# EAGLE design untitled (EAGLE 9.6.2)
UNTITLED: Arduio uno
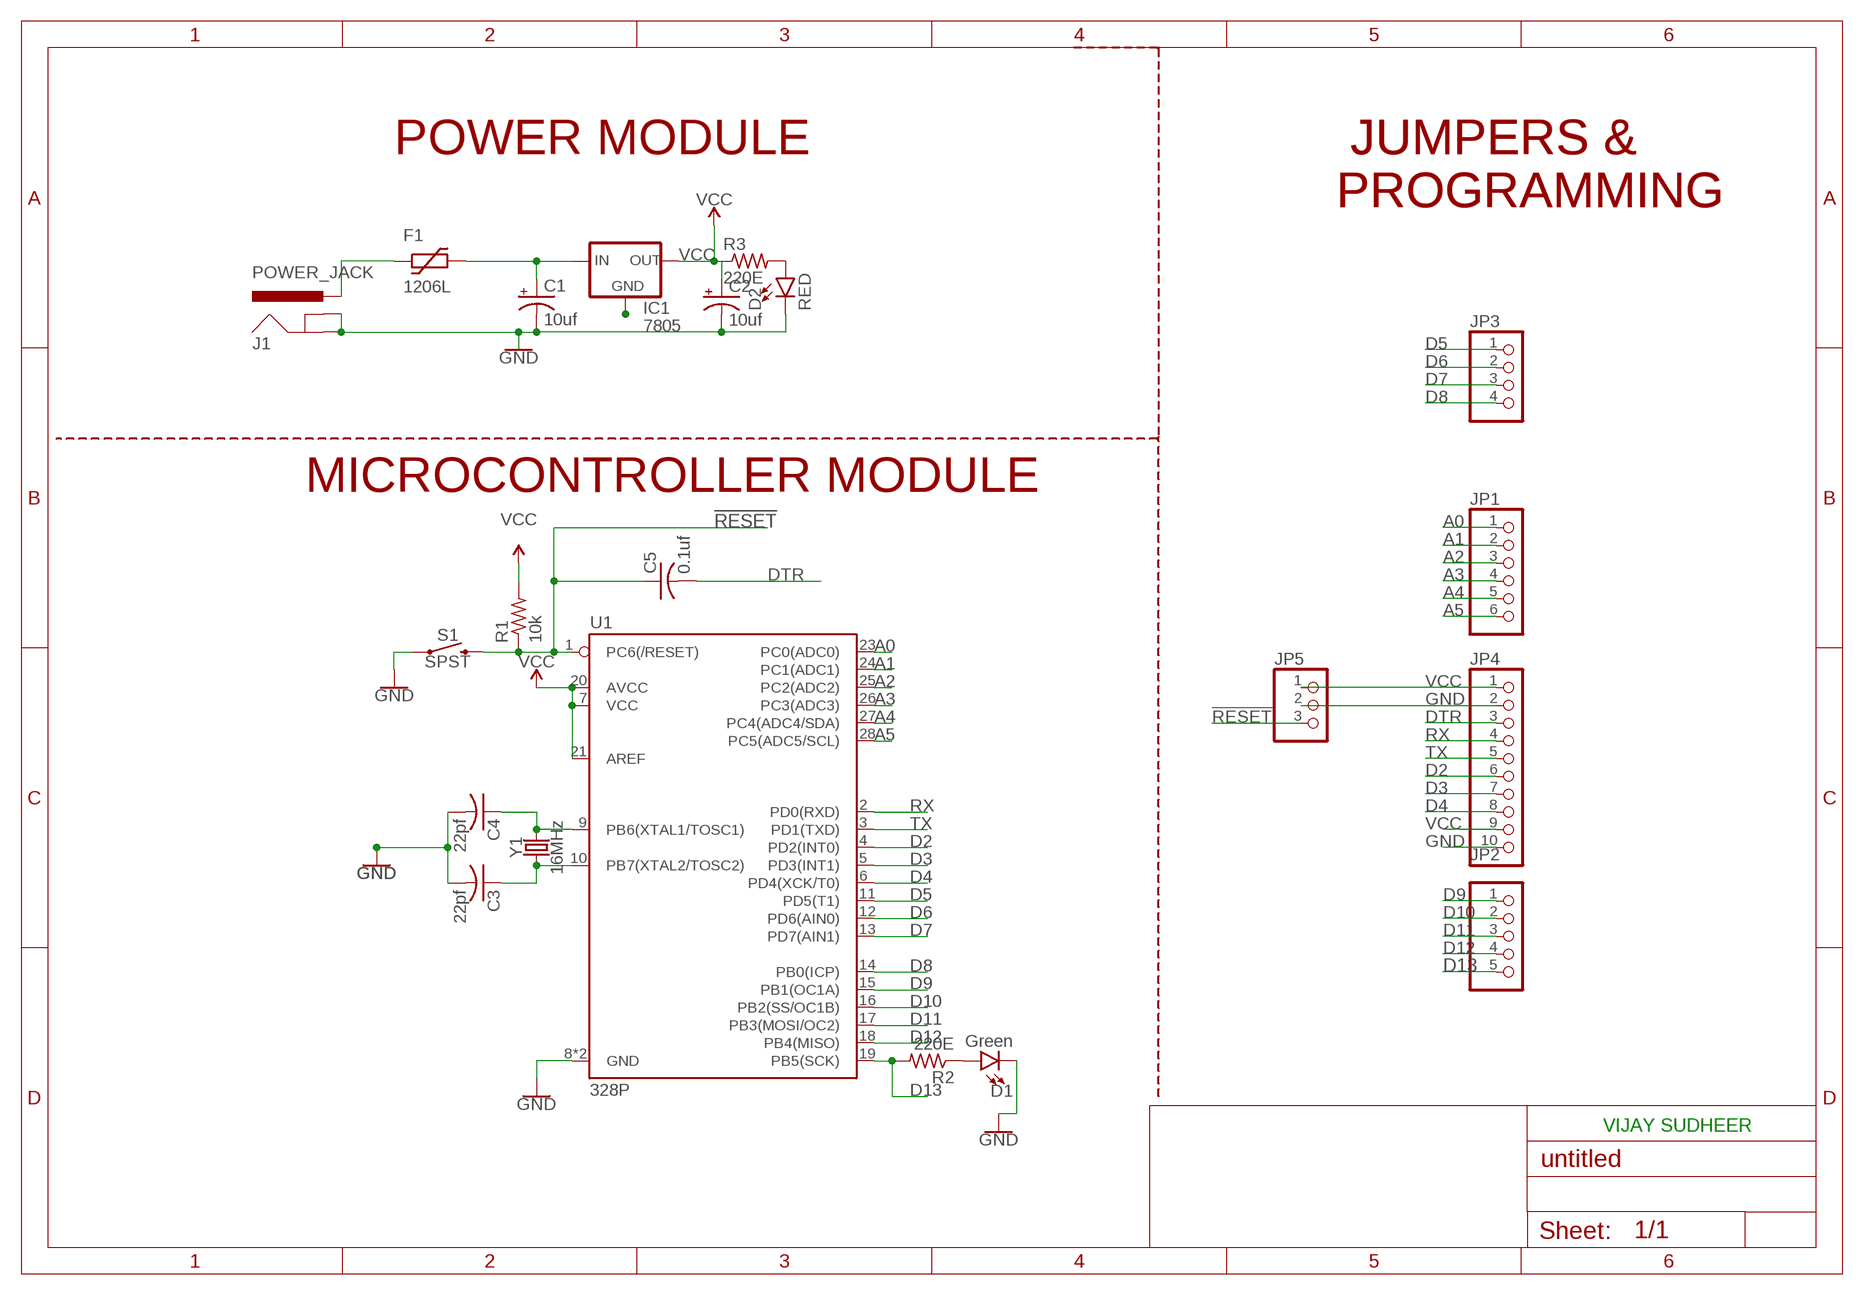
[diagram p0: schematic, sheet 1]

## Parts
C1  10uf  CPOL-USE2,5-6E  [E2,5-6E]
C2  10uf  CPOL-USE2,5-6E  [E2,5-6E]
C3  22pf  C-US025-024X044  [C025-024X044]
C4  22pf  C-US025-024X044  [C025-024X044]
C5  0.1uf  C-US025-024X044  [C025-024X044]
D1  Green  LED5MM  [LED_5MM]
D2  RED  LED5MM  [LED_5MM]
F1  1206L  [1206L]
IC1  7805  78XXS  [78XXS]
J1  POWER_JACK  [POWER_JACK_PTH]
JP1  PINHD-1X6  [1X06]
JP2  PINHD-1X5  [1X05]
JP3  PINHD-1X4  [1X04]
JP4  PINHD-1X10  [1X10]
JP5  PINHD-1X3  [1X03]
R1  10k  R-US_0204/7  [0204/7]
R2  220E  R-US_0204/7  [0204/7]
R3  220E  R-US_0204/7  [0204/7]
S1  SPST  MOMENTARY-SWITCH-SPST-PTH-6.0MM  [TACTILE_SWITCH_PTH_6.0MM]
U1  328P  ATMEGA328P_PDIP  [DIP28]
Y1  16MHz  CRYSTAL-16MHZPTH-HC49US  [HC49US]

## Nets
!RESET: C5.1 JP5.3 R1.1 S1.3 U1.1(PC6(/RESET))
A0: JP1.1 U1.23(PC0(ADC0))
A1: JP1.2 U1.24(PC1(ADC1))
A2: JP1.3 U1.25(PC2(ADC2))
A3: JP1.4 U1.26(PC3(ADC3))
A4: JP1.5 U1.27(PC4(ADC4/SDA))
A5: JP1.6 U1.28(PC5(ADC5/SCL))
D2: JP4.6 U1.4(PD2(INT0))
D3: JP4.7 U1.5(PD3(INT1))
D4: JP4.8 U1.6(PD4(XCK/T0))
D5: JP3.1 U1.11(PD5(T1))
D6: JP3.2 U1.12(PD6(AIN0))
D7: JP3.3 U1.13(PD7(AIN1))
D8: JP3.4 U1.14(PB0(ICP))
D9: JP2.1 U1.15(PB1(OC1A))
D10: JP2.2 U1.16(PB2(SS/OC1B))
D11: JP2.3 U1.17(PB3(MOSI/OC2))
D12: JP2.4 U1.18(PB4(MISO))
D13: JP2.5 R2.2 U1.19(PB5(SCK))
DTR: C5.2 JP4.3
GND: C1.- C2.- C3.2 C4.2 D1.K(C) D2.K(C) J1.GND J1.GNDBREAK JP4.2 JP4.10 JP5.2 S1.1 U1.8(GND) U1.22(GND)
N$1: C4.1 U1.9(PB6(XTAL1/TOSC1)) Y1.2
N$2: C1.+ F1.P$2 IC1.IN
N$3: C3.1 U1.10(PB7(XTAL2/TOSC2)) Y1.1
N$4: IC1.GND
N$5: D2.A R3.2
N$6: F1.P$1 J1.PWR
N$7: D1.A R2.1
RX: JP4.4 U1.2(PD0(RXD))
TX: JP4.5 U1.3(PD1(TXD))
VCC: C2.+ IC1.OUT JP4.1 JP4.9 JP5.1 R1.2 R3.1 U1.7(VCC) U1.20(AVCC) U1.21(AREF)

## Notes on the sheet
- POWER MODULE
- JUMPERS &
  PROGRAMMING
- JUMPERS &
  PROGRAMMING
- MICROCONTROLLER MODULE
- VIJAY SUDHEER

## Library data of the parts
C1 C2 = rcl:CPOL-US: POLARIZED CAPACITOR, American symbol; SPICEPREFIX: C
C3-C5 = rcl:C-US: CAPACITOR, American symbol; SPICEPREFIX: C
D1 D2 = SparkFun-LED:LED: LED (Generic) Standard schematic elements and footprints for 5mm, 3mm, 1206, and 0603 sized LEDs. Generic LEDs with no color specified.
F1 = ptc-littlefuse:1206L
IC1 = v-reg:78XXS: VOLTAGE REGULATOR
J1 = SparkFun-Connectors:POWER_JACK: Power Jack Connector This is the standard 5.5mm barrel jack for power. The PTH is the most common, proven, reliable, footprint. The Slot footprint only works if the mill layer is transmitted to the PCB fab house so be warned. Here are the connectors we sell at SparkFun: DC Barrel Power Jack/Connector <https://www.sparkfun.com/products/119> (PRT-00119) DC Barrel Power Jack/Connector (SMD) <https://www.sparkfun.com/products/12748> (PRT-12748) DC Barrel Jack Adapter - Breadboard Compatible <https://www.sparkfun.com/products/10811> (PRT-10811) It is used on this SparkFun product (and many, many others): SparkFun RedBoard - Programmed with Arduino <https://www.sparkfun.com/products/12757> (DEV-12757) Also, if you need a mating power supply or connector, please check these out: Wall Adapter Power Supply - 9VDC 650mA <https://www.sparkfun.com/products/298> (TOL-00298) DC Barrel Jack Adapter - Male <https://www.sparkfun.com/products/10287> (PRT-10287); PROD_ID: CONN-08197
JP1 = pinhead:PINHD-1X6: PIN HEADER
JP2 = pinhead:PINHD-1X5: PIN HEADER
JP3 = pinhead:PINHD-1X4: PIN HEADER
JP4 = pinhead:PINHD-1X10: PIN HEADER
JP5 = pinhead:PINHD-1X3: PIN HEADER
R1-R3 = rcl:R-US_: RESISTOR, American symbol; SPICEPREFIX: R
S1 = SparkFun-Switches:MOMENTARY-SWITCH-SPST: Momentary Switch (Pushbutton) - SPST Normally-open (NO) SPST momentary switches (buttons, pushbuttons). Variants PTH-12MM - 12mm square, through-hole Momentary Pushbutton Switch - 12mm Square <https://www.sparkfun.com/products/9190> (COM-09190) PTH-6.0MM, PTH-6.0MM-KIT - 6.0mm square, through-hole Mini Pushbutton Switch <https://www.sparkfun.com/products/97> (COM-00097) KIT package intended for soldering kit's - only one side of pads' copper is exposed. PTH-RIGHT-ANGLE-KIT - Right-angle, through-hole Right Angle Tactile Button <https://www.sparkfun.com/products/10791> - Used on SparkFun BigTime Watch Kit <https://www.sparkfun.com/products/11734> SMD-12MM - 12mm square, surface-mount Tactile Button - SMD (12mm) <https://www.sparkfun.com/products/12993> (COM-12993) Used on SparkFun PicoBoard <https://www.sparkfun.com/products/11888> SMD-4.5MM - 4.5mm Square Trackball Switch Used on SparkFun Blackberry Trackballer Breakout <https://www.sparkfun.com/products/13169> SMD-4.6MMX2.8MM - 4.60mm x 2.80mm, surface mount Used on SparkFun Pro Micro - RP2040 <https://www.sparkfun.com/products/17717> SMD-5.2MM, SMD-5.2-REDUNDANT - 5.2mm square, surface-mount Mini Pushbutton Switch - SMD <https://www.sparkfun.com/products/8720> (COM-08720) Used on Arduino Pro Mini <https://www.sparkfun.com/products/11114> REDUNDANT package connects both switch circuits together SMD-6.0X3.5MM - 6.0 x 3.5mm, surface mount Momentary Reset Switch SMD <https://www.sparkfun.com/products/8229> (COM-08229) SMD-6.2MM-TALL - 6.2mm square, surface mount Tactile Button - SMD (6mm) <https://www.sparkfun.com/products/12992> Used on SparkFun Digital Sandbox <https://www.sparkfun.com/products/12651> SMD-RIGHT-ANGLE - Right-angle, surface mount Used on SparkFun Block for Intel® Edison - Arduino <https://www.sparkfun.com/products/13036>; PROD_ID: SWCH-08441; SF_SKU: COM-00097
U1 = SparkFun-IC-Microcontroller:ATMEGA328P_PDIP: Atmel 328P Through hole ATMEGA328P uC used in the Arduino 32kb flash, 1k EEPROM, 2k SRAM Datasheet <http://www.sparkfun.com/datasheets/Components/SMD/ATMega328.pdf> SparkFun Products Storefront component: AVR 28 Pin 20MHz 32K 6A/D - ATMega328P <https://www.sparkfun.com/products/9061> (COM-09061) SparkFun Simon Says - Through-Hole Soldering Kit <https://www.sparkfun.com/products/10547> (KIT-10547) SparkFun Learn to Solder - Simon Says <https://www.sparkfun.com/products/13708> (KIT-13708) SparkFun BigTime Watch Kit <https://www.sparkfun.com/products/11734> (KIT-11734) SparkFun ClockIt <https://www.sparkfun.com/products/10930> (KIT-10930) SparkFun Serial Enabled LCD Kit <https://www.sparkfun.com/products/10097> (LCD-10097) SparkFun Simon Tilts - Through Hole Soldering Kit <https://www.sparkfun.com/products/12634> (KIT-12634) SparkFun Frequency Counter Kit <https://www.sparkfun.com/products/10140> (KIT-10140) FabFM Radio Kit <https://www.sparkfun.com/products/11043> (KIT-11043) SparkFun Binary Blaster Kit <https://www.sparkfun.com/products/12037> (KIT-12037) SparkFun Metro-Gnome <https://www.sparkfun.com/products/9236> (KIT-09236) ATmega328 with Arduino Optiboot (Uno) <https://www.sparkfun.com/products/10524> (DEV-10524); PROD_ID: IC-09136
Y1 = SparkFun-Clocks:CRYSTAL-16MHZ: 16MHz Crystal Digikey Example <http://www.digikey.com/product-search/en?keywords=535-9122-1-ND> Frequency: 16MHz Frequency Stability: ±50ppm Frequency Tolerance: ±20ppm Load Capacitance: 18pF SparkFun Products: Pro Micro -5V/16MHz <https://www.sparkfun.com/products/12640> SparkFun Serial Enabled LCD Kit <https://www.sparkfun.com/products/10097>; PROD_ID: XTAL-08181; SF_ID: COM-00536

## Board
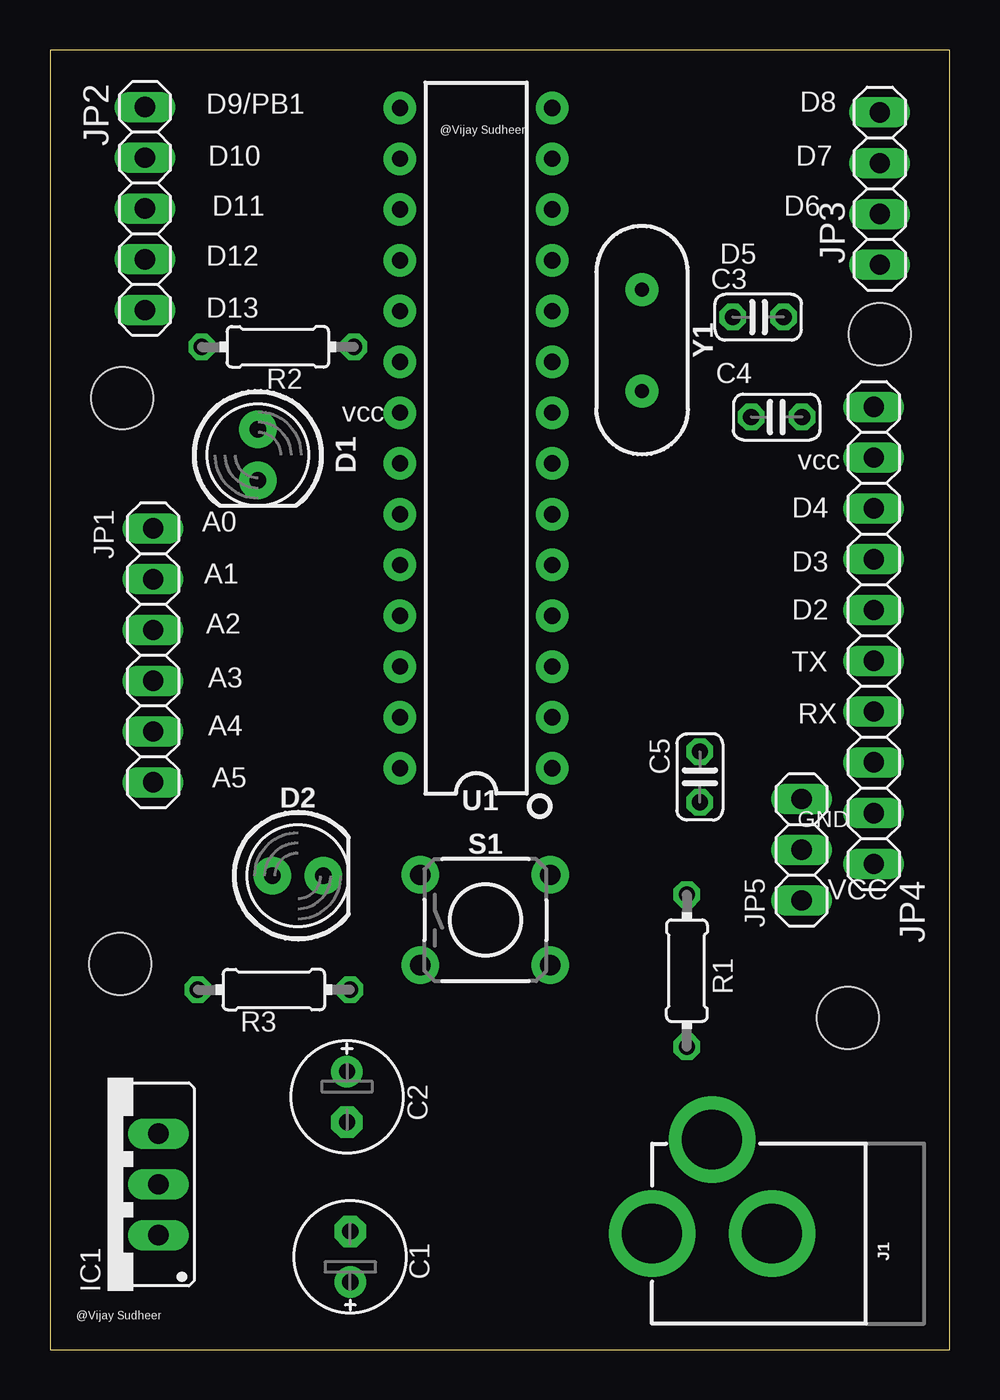
[diagram p1: board, top side]
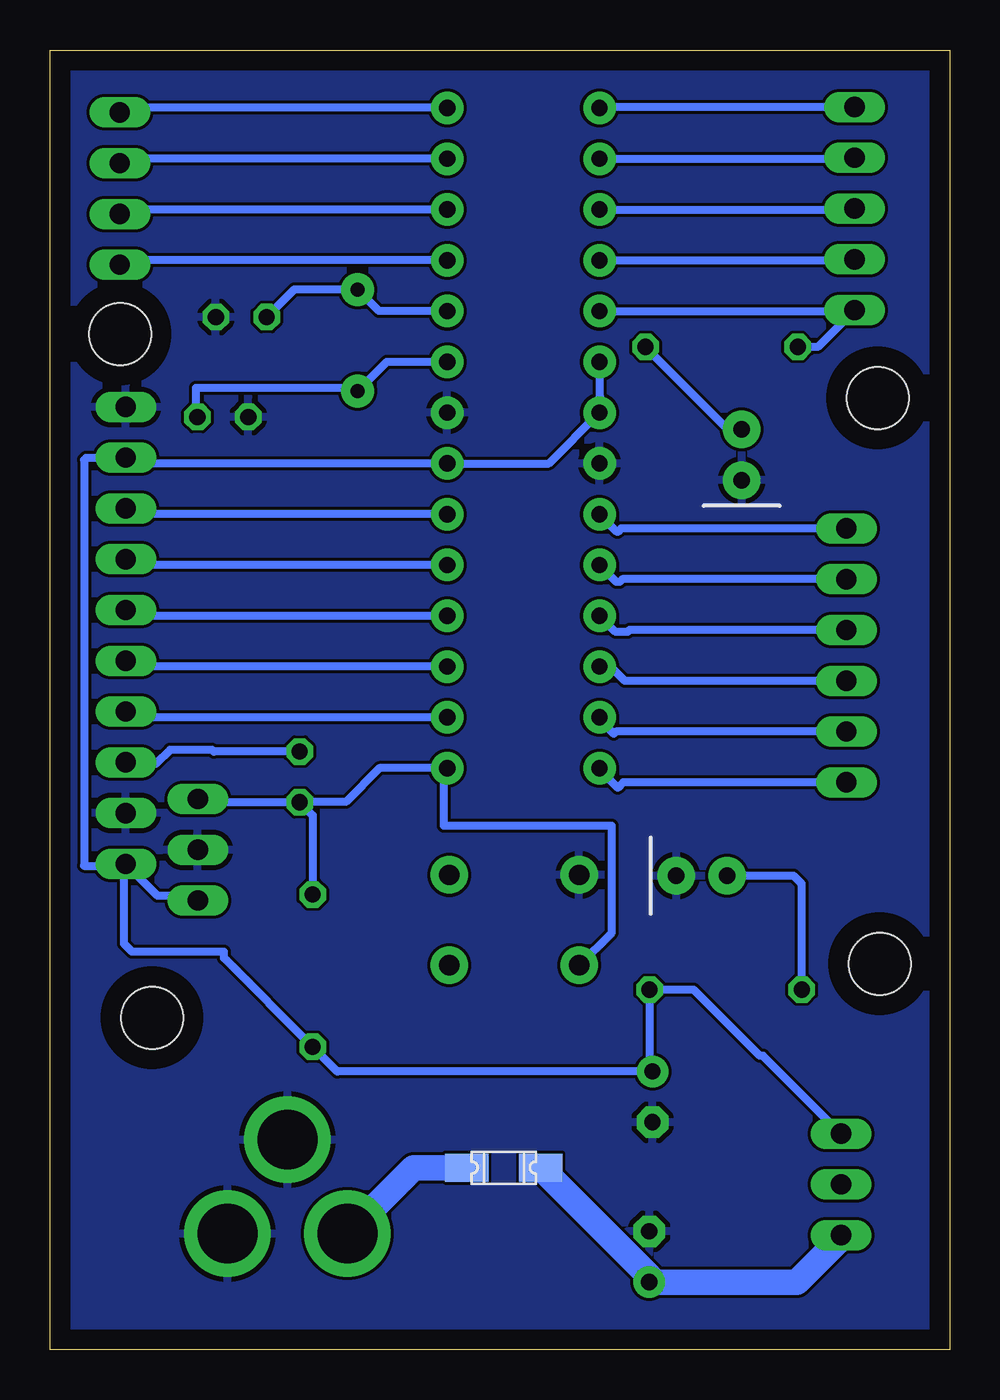
[diagram p2: board, bottom side, seen from below]

Size 45 x 65 mm. Coordinates in mm from the lower left corner, seen from the top.
Outline: 0,0 45,0 45,65 0,65 0,0
Copper layers (1*16): Top 0.035mm / dielectric 1.5mm / Bottom 0.035mm
Design rules "default": minimum track width 6mil, minimum drill 0.35mm, track to track 6mil, track to pad 6mil, pad to pad 6mil, via to via 6mil, smd to smd 6mil, copper to edge 40mil, drill to drill 6mil, minimum pad ring 10mil, minimum via ring 8mil, stop-mask expansion 4mil, vias tented up to drill 0mil, thermal gap 10mil
Holes 3.1 mm at 3.5,19.3 3.6,47.6 39.9,16.6 41.5,50.8

### Footprints (pad centres in the part's own frame; a part is rotated, then mirrored left to right if it is on the bottom)
E2,5-6E = drill 0.813 pad 1.575: + -1.27,0 | drill 0.813 pad 1.575 octagon: - 1.27,0
C025-024X044 = drill 0.813 octagon: 1 -1.27,0; 2 1.27,0
LED_5MM = drill 0.813 pad 1.88: A -1.27,0; K 1.27,0
1206L = smd 2.16 x 1.4: P$1 -1.85,0; P$2 1.85,0
78XXS = drill 1.016 long: GND 0,-2.54; IN -2.54,-2.54; OUT 2.54,-2.54
POWER_JACK_PTH = drill 2.997 pad 4.318: GND 0,7.7; GNDBREAK 4.7,10.7; PWR 0,13.7
1X06 = drill 1.016 long: 1 -6.35,0; 2 -3.81,0; 3 -1.27,0; 4 1.27,0; 5 3.81,0; 6 6.35,0
1X05 = drill 1.016 long: 1 -5.08,0; 2 -2.54,0; 3 0,0; 4 2.54,0; 5 5.08,0
1X04 = drill 1.016 long: 1 -3.81,0; 2 -1.27,0; 3 1.27,0; 4 3.81,0
1X10 = drill 1.016 long: 1 -11.43,0; 2 -8.89,0; 3 -6.35,0; 4 -3.81,0; 5 -1.27,0; 6 1.27,0; 7 3.81,0; 8 6.35,0; 9 8.89,0; 10 11.43,0
1X03 = drill 1.016 long: 1 -2.54,0; 2 0,0; 3 2.54,0
0204/7 = drill 0.813 octagon: 1 -3.81,0; 2 3.81,0
TACTILE_SWITCH_PTH_6.0MM = drill 1.016 pad 1.88: 1 -3.251,2.261; 2 3.251,2.261; 3 -3.251,-2.261; 4 3.251,-2.261
DIP28 = drill 0.813 pad 1.626: 1 -16.51,-3.81; 2 -13.97,-3.81; 3 -11.43,-3.81; 4 -8.89,-3.81; 5 -6.35,-3.81; 6 -3.81,-3.81; 7 -1.27,-3.81; 8 1.27,-3.81; 9 3.81,-3.81; 10 6.35,-3.81; 11 8.89,-3.81; 12 11.43,-3.81; 13 13.97,-3.81; 14 16.51,-3.81; 15 16.51,3.81; 16 13.97,3.81; 17 11.43,3.81; 18 8.89,3.81; 19 6.35,3.81; 20 3.81,3.81; 21 1.27,3.81; 22 -1.27,3.81; 23 -3.81,3.81; 24 -6.35,3.81; 25 -8.89,3.81; 26 -11.43,3.81; 27 -13.97,3.81; 28 -16.51,3.81
HC49US = drill 0.7 pad 1.651: 1 -2.54,0; 2 2.54,0

### Placement (x,y rotation side)
C1  15.02,4.64 90 top
C2  14.86,12.64 270 top
C3  35.43,51.64 0 top
C4  36.35,46.64 180 top
C5  32.51,28.64 90 top
D1  10.4,44.75 270 top
D2  12.4,23.7 0 top
F1  22.3,9.1 0 bottom
IC1  2.89,8.26 90 top
J1  43.82,5.8 90 top
JP1  5.16,34.72 270 top
JP2  4.75,57.07 270 top
JP3  41.51,58.07 90 top
JP4  41.21,35.72 90 top
JP5  37.6,25 90 top
R1  31.86,18.95 270 top
R2  11.4,50.15 180 top
R3  11.2,18 180 top
S1  21.78,21.48 0 top
U1  21.32,45.59 90 top
Y1  29.62,50.48 270 top

### Tracks (layer width: path | path; a pad name or v marks a point on that pad's centre or on a via)
!RESET
  Bottom 0.406: U1.1 25.3,29.08 | 25.3,29.08 28.52,29.08 30.2,27.4 32.2,27.4 32.48,27.4 | 32.48,27.4 C5.1 31.86,26.72 R1.1 | S1.3 16.9,20.85 16.9,26.2 25.3,26.2 25.3,29.08 | JP5.3 37.46,27.4 32.48,27.4
A0
  Bottom 0.406: JP1.1 16.43,41.07 16.6,40.9 16.63,40.9 U1.23
A1
  Bottom 0.406: JP1.2 16.37,38.53 16.5,38.4 16.67,38.4 U1.24
A2
  Bottom 0.406: JP1.3 16.01,35.99 16.1,35.9 16.71,35.9 U1.25
A3
  Bottom 0.406: JP1.4 16.25,33.45 16.96,34.16 U1.26
A4
  Bottom 0.406: JP1.5 16.69,30.91 16.8,30.8 17.51,31.51 U1.27
A5
  Bottom 0.406: JP1.6 16.33,28.37 16.6,28.1 17.51,29.01 U1.28
D2
  Bottom 0.406: U1.4 40.92,36.7 JP4.6
D3
  Bottom 0.406: U1.5 40.92,39.24 JP4.7
D4
  Bottom 0.406: U1.6 40.92,41.78 JP4.8
D5
  Bottom 0.406: U1.11 41.29,54.48 JP3.1
D6
  Bottom 0.406: U1.12 41.29,57.02 JP3.2
D7
  Bottom 0.406: U1.13 41.29,59.56 JP3.3
D8
  Bottom 0.406: U1.14 41.29,62.1 JP3.4
D9
  Bottom 0.406: JP2.1 17.46,62.15 U1.15
D10
  Bottom 0.406: U1.16 4.8,59.56 JP2.2
D11
  Bottom 0.406: U1.17 4.8,57.02 JP2.3
D12
  Bottom 0.406: U1.18 4.8,54.48 JP2.4
D13
  Bottom 0.406: U1.19 4.8,51.94 JP2.5 6.59,50.15 R2.2
DTR
  Bottom 0.406: C5.2 36.81,29.91 36.9,30 39,30 39.7,29.3 41.14,29.3 JP4.3
GND
  pour Bottom: 0.1,-0.3 44.9,-0.3 45.2,0 45.2,65 0.2,65 0,64.8 0,-0.3
N$1
  Bottom 0.406: U1.9 28.16,49.4 Y1.2 29.78,48.1 37.7,48.1 37.7,46.72 C4.1
N$2
  Bottom 1.27: IC1.IN 5.43,5.57 7.63,3.37 C1.+ 15.02,3.67 F1.P$2
N$3
  Bottom 0.406: U1.10 28.54,51.94 Y1.1 32.78,53.02 C3.1
N$5
  Bottom 0.406: R3.2 7.39,23.29 7.8,23.7 D2.A
N$6
  Bottom 1.27: F1.P$1 26.82,9.1 J1.PWR
N$7
  Bottom 0.406: D1.A 11.08,46.02 R2.1
RX
  Bottom 0.406: U1.2 40.92,31.62 JP4.4
TX
  Bottom 0.406: U1.3 40.92,34.16 JP4.5
VCC
  Bottom 0.406: IC1.OUT 9.33,14.7 9.5,14.7 12.8,18 R3.1 15.01,14.06 C2.+ 30.63,13.91 R1.2 36.3,19.58 36.3,19.9 40.9,19.9 41.3,20.3 41.3,24.2 | U1.20 17.51,47.71 17.5,47.7 U1.21 20.05,44.32 U1.7 40.92,44.32 JP4.9 43.19,44.61 43.3,44.5 43.3,24.2 41.3,24.2 | JP5.1 37.84,22.7 39.62,22.7 JP4.1 41.3,24.2

### Text on the board
tNames: D9/PB1 | D8 | @Vijay Sudheer | D10 | D7 | D11 | D6 | D12 | D5 | D13 | vcc | vcc | D4 | A0 | D3 | A1 | A2 | D2 | TX | A3 | A4 | RX | A5 | GND | VCC | @Vijay Sudheer